# Altium schematic sheet Simple_EEM_Controller.SchDoc: =SheetTitle_Top
size 420 x 297 mm; EDA_Number: ARTIQ; Author: G.Kasprowicz; CompanyName: WUT ISE; DrawnBy: G.Kasprowicz; Organization: WUT ISE; Address1: PW ISE; Address2: Nowowiejska 15/19 00-665 Warsaw; Address3: gkasprow@gmail.com; ModifiedBy: -; CheckedDate: -; Title2: Top; DivGrp: WUT ISE; Designer: G.Kasprowicz; ModifiedDate: -; ProjectName: Sensor Box
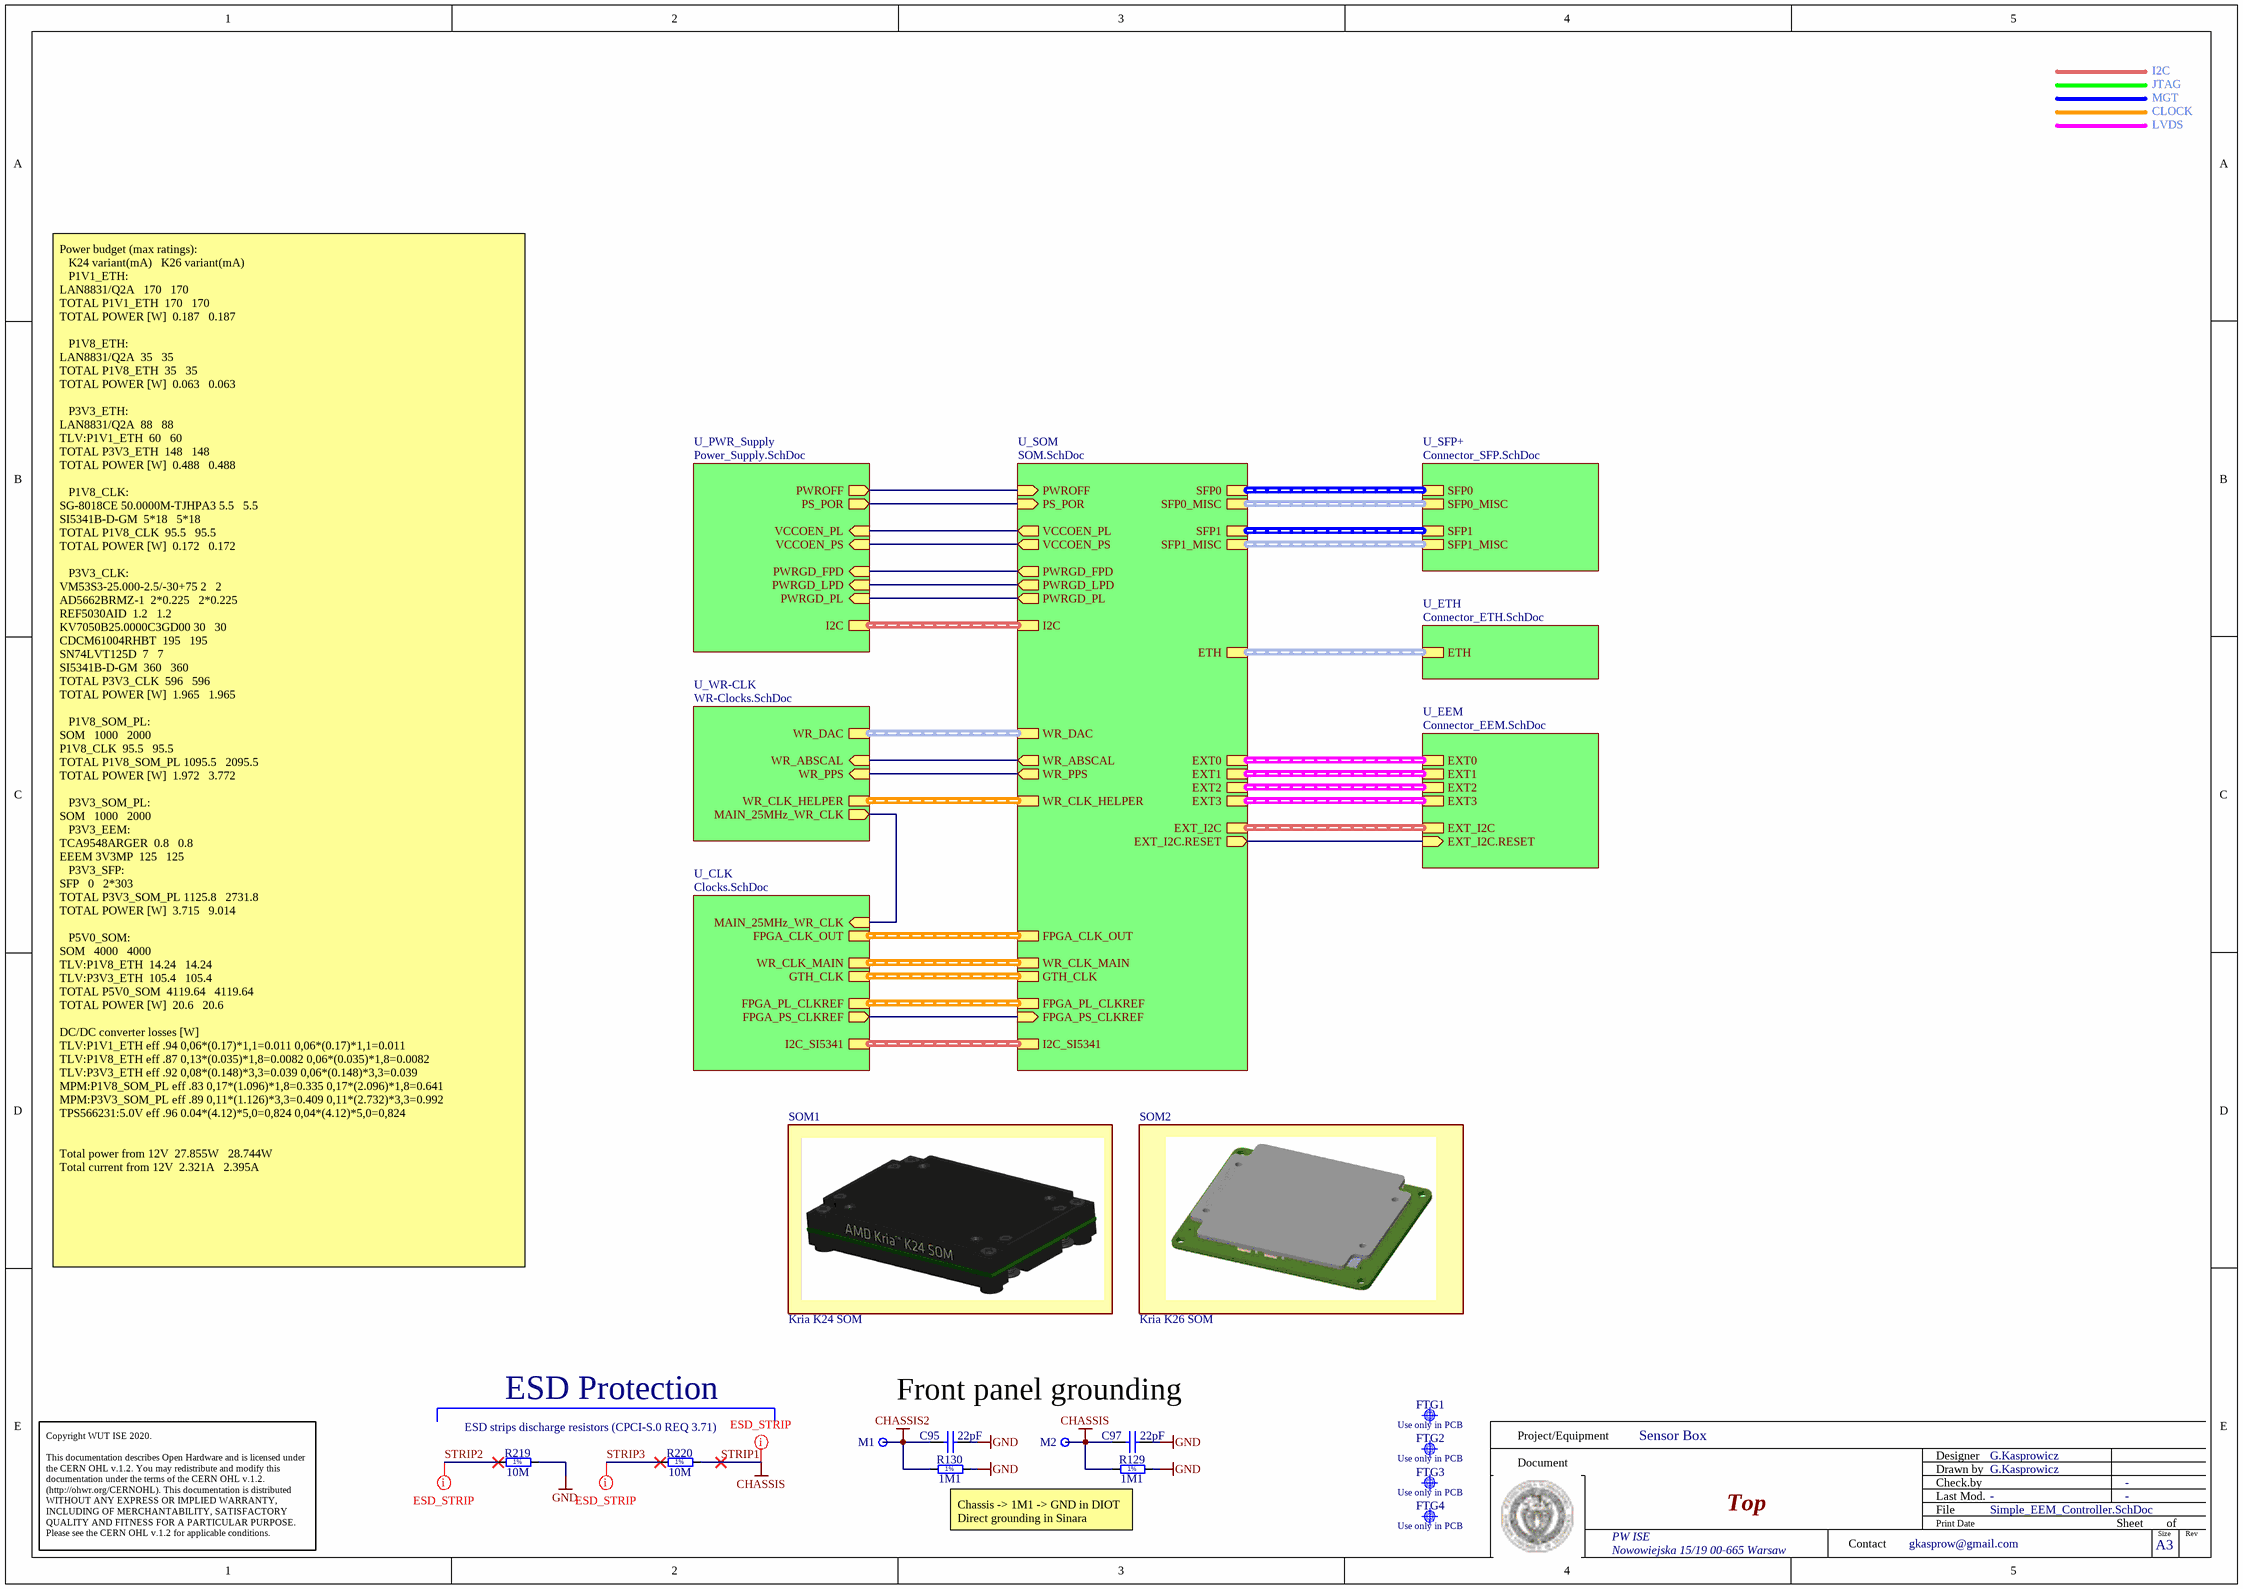
[diagram p0: Simple_EEM_Controller.SchDoc]

## Parts
C95  22pF  [CAPC1005X55N]
C97  22pF  [CAPC1005X55N]
FTG1  Use only in PCB  [FIDUCIAL_TOP_C100-200]  (no BOM)
FTG2  Use only in PCB  [FIDUCIAL_TOP_S100-200]  (no BOM)
FTG3  Use only in PCB  [FIDUCIAL_TOP_S100-200]  (no BOM)
FTG4  Use only in PCB  [FIDUCIAL_TOP_S100-200]  (no BOM)
M1  Plated Hole  [MTG300_600]  (value not drawn)  (no BOM)
M2  Plated Hole  [MTG300_600]  (value not drawn)  (no BOM)
R129  1M1  [RESC2012X60N]
R130  1M1  [RESC2012X60N]
R219  10M  [RESC2113X55N]
R220  10M  [RESC2113X55N]
SOM1  Kria K24 SOM  [Kria K24 SOM]
SOM2  Kria K26 SOM  [Kria K26 SOM]

## Sub-sheets
U_CLK = Clocks.SchDoc: GTH_CLK (harness GTH_CLK), MAIN_25MHz_WR_CLK (in), I2C_SI5341 (harness I2C), FPGA_PS_CLKREF (out), FPGA_PL_CLKREF (harness CLK_DIFF), FPGA_CLK_OUT (harness CLK_DIFF), WR_CLK_MAIN (harness CLK_DIFF)
U_EEM = Connector_EEM.SchDoc: EXT_I2C.RESET (in), EXT_I2C (harness EEM_I2C), EXT2 (harness EEM_LVDS), EXT0 (harness EEM_LVDS), EXT1 (harness EEM_LVDS), EXT3 (harness EEM_LVDS)
U_ETH = Connector_ETH.SchDoc: ETH (harness ETH)
U_PWR_Supply = Power_Supply.SchDoc: PWROFF (out), PS_POR (out), VCCOEN_PL (in), VCCOEN_PS (in), PWRGD_FPD (in), PWRGD_LPD (in), PWRGD_PL (in), I2C (harness I2C)
U_SFP+ = Connector_SFP.SchDoc: SFP0 (harness SFP), SFP0_MISC (harness SFP_MISC), SFP1 (harness SFP), SFP1_MISC (harness SFP_MISC)
U_SOM = SOM.SchDoc: SFP0 (harness SFP), SFP0_MISC (harness SFP_MISC), SFP1 (harness SFP), SFP1_MISC (harness SFP_MISC), ETH (harness ETH), EXT2 (harness EEM_LVDS), EXT0 (harness EEM_LVDS), EXT1 (harness EEM_LVDS), EXT3 (harness EEM_LVDS), EXT_I2C (harness EEM_I2C), PWROFF (in), PS_POR (in), PWRGD_FPD (out), VCCOEN_PS (out), PWRGD_PL (out), PWRGD_LPD (out), VCCOEN_PL (out), EXT_I2C.RESET (out), I2C (harness I2C), GTH_CLK (harness GTH_CLK), WR_ABSCAL (out), WR_PPS (out), WR_CLK_HELPER (harness CLK_DIFF), FPGA_PS_CLKREF (in), WR_DAC (harness WR_DAC_H), FPGA_PL_CLKREF (harness CLK_DIFF), WR_CLK_MAIN (harness CLK_DIFF), FPGA_CLK_OUT (harness CLK_DIFF), I2C_SI5341 (harness I2C)
U_WR-CLK = WR-Clocks.SchDoc: WR_DAC (harness WR_DAC_H), WR_CLK_HELPER (harness CLK_DIFF), WR_PPS (in), WR_ABSCAL (in), MAIN_25MHz_WR_CLK (out)

## Nets
CHASSIS2: C95.1 M1.1 R130.1
GND: C95.2 C97.2 R129.2 R130.2 R219.2
STRIP1: C97.1 M2.1 R129.1 R220.2  [also labelled CHASSIS]
STRIP2: R219.1
STRIP3: R220.1
(unnamed): sheet U_EEM/EXT_I2C.RESET, sheet U_SOM/EXT_I2C.RESET
(unnamed): sheet U_SOM/PWROFF, sheet U_PWR_Supply/PWROFF
(unnamed): sheet U_SOM/PS_POR, sheet U_PWR_Supply/PS_POR
(unnamed): sheet U_SOM/PWRGD_FPD, sheet U_PWR_Supply/PWRGD_FPD
(unnamed): sheet U_SOM/VCCOEN_PS, sheet U_PWR_Supply/VCCOEN_PS
(unnamed): sheet U_SOM/PWRGD_PL, sheet U_PWR_Supply/PWRGD_PL
(unnamed): sheet U_SOM/PWRGD_LPD, sheet U_PWR_Supply/PWRGD_LPD
(unnamed): sheet U_SOM/VCCOEN_PL, sheet U_PWR_Supply/VCCOEN_PL
(unnamed): sheet U_SOM/WR_ABSCAL, sheet U_WR-CLK/WR_ABSCAL
(unnamed): sheet U_SOM/WR_PPS, sheet U_WR-CLK/WR_PPS
(unnamed): sheet U_SOM/FPGA_PS_CLKREF, sheet U_CLK/FPGA_PS_CLKREF
(unnamed): sheet U_CLK/MAIN_25MHz_WR_CLK, sheet U_WR-CLK/MAIN_25MHz_WR_CLK

## Buses and harness runs
harness sheet U_CLK/FPGA_CLK_OUT = sheet U_SOM/FPGA_CLK_OUT
harness sheet U_CLK/FPGA_PL_CLKREF = sheet U_SOM/FPGA_PL_CLKREF
harness sheet U_CLK/GTH_CLK = sheet U_SOM/GTH_CLK
harness sheet U_CLK/I2C_SI5341 = sheet U_SOM/I2C_SI5341
harness sheet U_CLK/WR_CLK_MAIN = sheet U_SOM/WR_CLK_MAIN
harness sheet U_EEM/EXT0 = sheet U_SOM/EXT0
harness sheet U_EEM/EXT1 = sheet U_SOM/EXT1
harness sheet U_EEM/EXT2 = sheet U_SOM/EXT2
harness sheet U_EEM/EXT3 = sheet U_SOM/EXT3
harness sheet U_EEM/EXT_I2C = sheet U_SOM/EXT_I2C
harness sheet U_ETH/ETH = sheet U_SOM/ETH
harness sheet U_PWR_Supply/I2C = sheet U_SOM/I2C
harness sheet U_SFP+/SFP0 = sheet U_SOM/SFP0
harness sheet U_SFP+/SFP0_MISC = sheet U_SOM/SFP0_MISC
harness sheet U_SFP+/SFP1 = sheet U_SOM/SFP1
harness sheet U_SFP+/SFP1_MISC = sheet U_SOM/SFP1_MISC
harness sheet U_SOM/WR_CLK_HELPER = sheet U_WR-CLK/WR_CLK_HELPER
harness sheet U_SOM/WR_DAC = sheet U_WR-CLK/WR_DAC

## Layout directives
net class ESD_STRIP: STRIP1, STRIP2, STRIP3

## Notes on the sheet
- I2C
- JTAG
- MGT
- CLOCK
- LVDS
- Power budget (max ratings):
  K24 variant(mA)	 	K26 variant(mA)
  P1V1_ETH:
  LAN8831/Q2A 		170			170
  TOTAL P1V1_ETH		170			170
  TOTAL POWER [W]		0.187			0.187
  P1V8_ETH:
  LAN8831/Q2A		35			35
  TOTAL P1V8_ETH		35			35
  TOTAL POWER [W]		0.063			0.063
  P3V3_ETH:
  LAN8831/Q2A		88			88
  TLV:P1V1_ETH		60			60
  TOTAL P3V3_ETH		148			148
  TOTAL POWER [W]		0.488			0.488
  P1V8_CLK:
  SG-8018CE 50.0000M-TJHPA3	5.5			5.5
  SI5341B-D-GM		5*18			5*18
  TOTAL P1V8_CLK		95.5			95.5
  TOTAL POWER [W]		0.172			0.172
  P3V3_CLK:
  VM53S3-25.000-2.5/-30+75	2			2
  AD5662BRMZ-1		2*0.225			2*0.225
  REF5030AID		1.2			1.2
  KV7050B25.0000C3GD00	30			30
  CDCM61004RHBT		195			195
  SN74LVT125D		7			7
  SI5341B-D-GM		360			360
  TOTAL P3V3_CLK		596			596
  TOTAL POWER [W]		1.965			1.965
  P1V8_SOM_PL:
  SOM			1000			2000
  P1V8_CLK		95.5			95.5
  TOTAL P1V8_SOM_PL	1095.5			2095.5
  TOTAL POWER [W]		1.972			3.772
  P3V3_SOM_PL:
  SOM			1000			2000
  P3V3_EEM:
  TCA9548ARGER		0.8			0.8
  EEEM 3V3MP		125			125
  P3V3_SFP:
  SFP			0			2*303
  TOTAL P3V3_SOM_PL	1125.8			2731.8
  TOTAL POWER [W]		3.715			9.014
  P5V0_SOM:
  SOM			4000			4000
  TLV:P1V8_ETH		14.24			14.24
  TLV:P3V3_ETH		105.4			105.4
  TOTAL P5V0_SOM		4119.64			4119.64
  TOTAL POWER [W]		20.6			20.6
  DC/DC converter losses [W]
  TLV:P1V1_ETH eff .94	0,06*(0.17)*1,1=0.011	0,06*(0.17)*1,1=0.011
  TLV:P1V8_ETH eff .87	0,13*(0.035)*1,8=0.0082	0,06*(0.035)*1,8=0.0082
  TLV:P3V3_ETH eff .92	0,08*(0.148)*3,3=0.039	0,06*(0.148)*3,3=0.039
  MPM:P1V8_SOM_PL eff .83	0,17*(1.096)*1,8=0.335	0,17*(2.096)*1,8=0.641
  MPM:P3V3_SOM_PL eff .89	0,11*(1.126)*3,3=0.409	0,11*(2.732)*3,3=0.992
  TPS566231:5.0V eff .96	0.04*(4.12)*5,0=0,824	0,04*(4.12)*5,0=0,824
  Total power from 12V 	27.855W			28.744W
  Total current from 12V 	2.321A			2.395A
- ESD Protection
- Front panel grounding
- ESD strips discharge resistors (CPCI-S.0 REQ 3.71)
- Chassis -> 1M1 -> GND in DIOT
  Direct grounding in Sinara
- Project/Equipment
- Document
- Designer
- Drawn by
- Check.by
- Copyright WUT ISE 2020.
  This documentation describes Open Hardware and is licensed under the CERN OHL v.1.2. You may redistribute and modify this documentation under the terms of the CERN OHL v.1.2. (http://ohwr.org/CERNOHL). This documentation is distributed WITHOUT ANY EXPRESS OR IMPLIED WARRANTY, INCLUDING OF MERCHANTABILITY, SATISFACTORY QUALITY AND FITNESS FOR A PARTICULAR PURPOSE. Please see the CERN OHL v.1.2 for applicable conditions.
- Contact
- File
- Last Mod.
- Print Date
- Sheet
- Size
- A3
- of
- Rev
- (in symbol R0805_1M1_1%_0.125W_100PPM) 1%
- (in symbol R0805_10M_1%_0.125W_100PPM_VISHAY_CRCW e3) 1%

## Library data of the parts
C95 C97 = CC0402_22PF_50V_5%_C0G: Non-polarised capacitor; Part Description: SMD Multilayer Chip Ceramic Capacitor; Manufacturer: GENERIC; Manufacturer1 Part Number: C0402C220J5GACTU; Voltage: 50V; TC: C0G/NP0; Tolerance: ±5%; Part Number: CC0402_22PF_50V_5%_C0G; Component Kind: Standard; Component Type: Standard; Pin Count: 2; Value: 22pF; Status: Preferred; Manufacturer Part Number: CC0402_22PF_50V_5%_C0G; Case: 0402; Mounted: Yes; Socket: No; SMD: Yes; Manufacturer1 Example: KEMET; Manufacturer1 ComponentHeight: 0.55mm; HelpURL: \\cern.ch\dfs\Applications\Altium\Datasheets\CC0402_C0G_KEMET_(Commercial Grade).pdf; Author: CERN DEM JLC; CreateDate: 2007-12-03; LatestRevisionDate: 2007-12-03; Sense: No
FTG1 = FIDUCIAL_TARGET_C100-200: Fiducial Target; Part Description: Round Fiducial Target, Top Layer, 1.0mm, Top Solder 2.0mm, Keepout =2.0mm; Mounted: No; Part Number: FIDUCIAL_TARGET_C100-200; Component Type: Standard (No BOM); Pin Count: 1; Family: Fiducial; Socket: No; SMD: Yes; Sense: No; Status: None; ComponentHeight: 0mm; HelpURL: Undefined; Author: CERN DEM JLC; CreateDate: 09.02.2010; LatestRevisionDate: 04.04.2012; PackageDescription: Round Fiducial Target, Top Layer, 1.0mm, Top Solder 2.0mm, Keepout =2.0mm
FTG2-FTG4 = FIDUCIAL_TARGET_S100-200: Fiducial Target; Part Description: Square Fiducial Target, Top Layer, 1.0mm, Top Solder 2.0mm, Keepout =2.0mm; Mounted: No; Part Number: FIDUCIAL_TARGET_S100-200; Component Type: Standard (No BOM); Pin Count: 1; Family: Fiducial; Socket: No; SMD: Yes; Sense: No; Status: None; ComponentHeight: 0mm; HelpURL: Undefined; Author: CERN DEM JLC; CreateDate: 09.02.2010; LatestRevisionDate: 04.04.2012; PackageDescription: Square Fiducial Target, Top Layer, 1.0mm, Top Solder 2.0mm, Keepout =2.0mm
M1 M2 = PLATED_HOLE3.0_PAD6.0: Single Terminal Socket; Part Description: Plated Through Hole: Hole Dia.=3.0mm Pad Dia.=6.0mm; Mounted: No; Table: Pads; Part Number: PLATED_HOLE3.0_PAD6.0; Component Type: Standard (No BOM); Designator: Single Terminal Socket; Library Reference: Single Terminal Socket; Pin Count: 1; Family: Plated Hole; Socket: No; SMD: No; Status: None; ComponentHeight: 0mm; Author: CERN DEM JLC; CreateDate: 26.05.2008; LatestRevisionDate: 26.05.2008; PackageDescription: Plated Through Hole: Hole Dia.=3.0mm Pad Dia.=6.0mm
R129 R130 = R0805_1M1_1%_0.125W_100PPM: Resistor - 1%; Part Description: General Purpose Thick Film Chip Resistor; Manufacturer: GENERIC; Manufacturer1 Part Number: NRC10F1104TRF; PressFit: No; Part Number: R0805_1M1_1%_0.125W_100PPM; Component Kind: Standard; Component Type: Standard; Pin Count: 2; Value: 1M1; Status: Preferred; Manufacturer Part Number: R0805_1M1_1%_0.125W_100PPM; Case: 0805; Mounted: Yes; Sense: No; Socket: No; SMD: Yes; Manufacturer1 Example: NIC COMPONENT; Manufacturer1 ComponentHeight: 0.6mm; HelpURL: \\cern.ch\dfs\Applications\Altium\Datasheets\R0805_NIC_NRC.pdf; Author: CERN DEM JLC; CreateDate: 03/12/2007; LatestRevisionDate: 13/03/2008
R219 R220 = R0805_10M_1%_0.125W_100PPM_VISHAY_CRCW e3: Resistor - 1%; Part Description: 150V, Standard Thick Film Chip Resistor; Manufacturer: VISHAY DALE; Manufacturer Part Number: CRCW080510M0FKEA; Power: 0.125W; TC: ±100ppm/°C; PressFit: No; Part Number: R0805_10M_1%_0.125W_100PPM_VISHAY_CRCW e3; Component Kind: Standard; Component Type: Standard; Pin Count: 2; Value: 10M; Status: None; Tolerance: ±1%; Case: 0805; Mounted: Yes; Sense: No; Socket: No; SMD: Yes; ComponentHeight: 0.5mm; HelpURL: \\cern.ch\dfs\Applications\Altium\Datasheets\R0805_VISHAY_CRCW e3.pdf; Author: CERN DEM BC; CreateDate: 2019-11-12; LatestRevisionDate: 2019-11-12
SOM1 = K24: Manufacturer: AMD; Part Number: Kria K24 SOM
SOM2 = K26: Manufacturer: AMD; Part Number: Kria K26 SOM